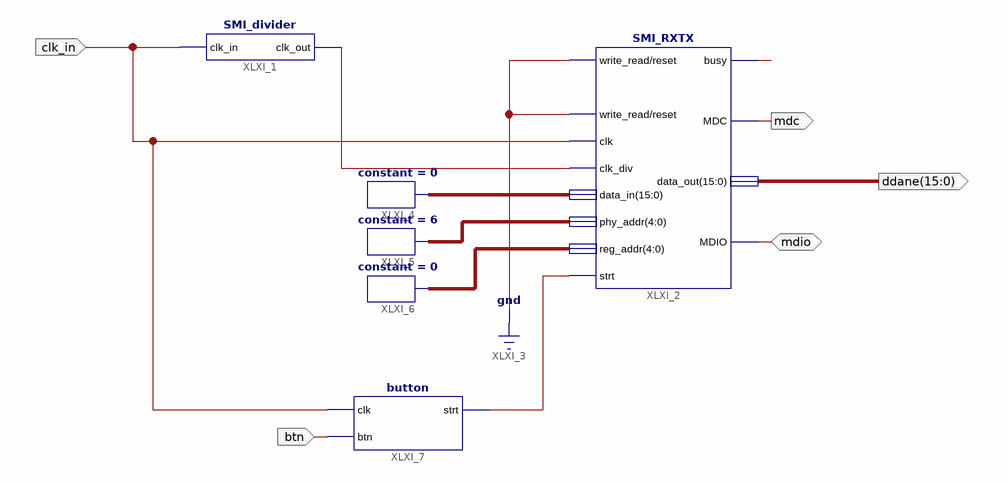
[diagram p0: schematic sheet 1]
// Xilinx ISE schematic test.sch (spartan3e) as structural Verilog: 6 symbols, 5 ports
module test (
  input  clk_in,
  input  btn,
  inout  mdio,
  output [15:0] ddane,
  output mdc
);

  wire busy, XLXN_2, XLXN_9;
  wire [4:0] XLXN_6, XLXN_7;
  wire [15:0] XLXN_5;

  SMI_divider XLXI_1 (.clk_in(clk_in), .clk_out(XLXN_2));
  SMI_RXTX XLXI_2 (
    .write_read(1'b0), .reset(1'b0), .clk(clk_in), .clk_div(XLXN_2), .data_in(XLXN_5), .phy_addr(XLXN_6),
    .reg_addr(XLXN_7), .MDIO(mdio), .busy(busy), .MDC(mdc), .data_out(ddane), .strt(XLXN_9));
  constant #(.CValue("0")) XLXI_4 (.O(XLXN_5));
  constant #(.CValue("6")) XLXI_5 (.O(XLXN_6));
  constant #(.CValue("0")) XLXI_6 (.O(XLXN_7));
  button XLXI_7 (.clk(clk_in), .btn(btn), .strt(XLXN_9));
endmodule
